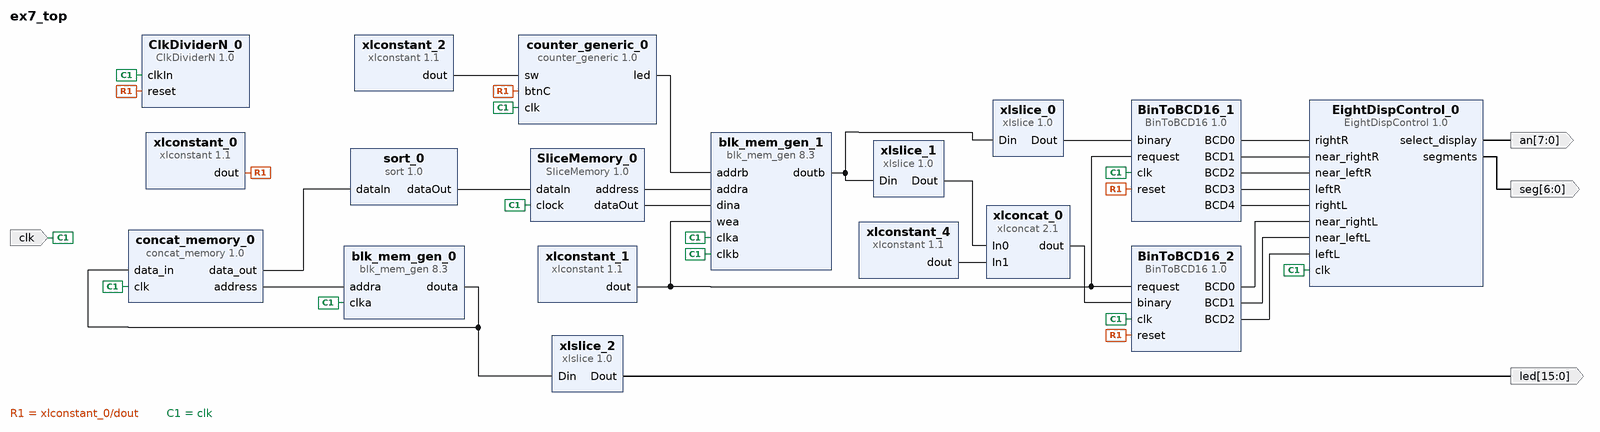
[diagram p0: block diagram of the top level]
# Vivado block design ex7_top, xc7a100tcsg324-3, Vivado 2016.4
create_bd_design ex7_top

create_bd_port -dir I clk
create_bd_port -dir O -from 7 -to 0 an
create_bd_port -dir O -from 6 -to 0 seg
create_bd_port -dir O -from 15 -to 0 led

create_bd_cell -type ip -vlnv xilinx.com:ip:blk_mem_gen:8.3 blk_mem_gen_0
set_property -dict [list \
  CONFIG.Memory_Type Single_Port_ROM \
  CONFIG.Enable_32bit_Address false \
  CONFIG.Write_Width_A 22 \
  CONFIG.Enable_A Always_Enabled \
  CONFIG.Register_PortA_Output_of_Memory_Primitives true \
  CONFIG.Load_Init_File true \
  CONFIG.Coe_File ../../../../../../../ex1/vector16_8bits_random.coe \
  CONFIG.Use_RSTA_Pin false \
  CONFIG.Port_A_Write_Rate 0 \
  CONFIG.use_bram_block Stand_Alone \
] [get_bd_cells blk_mem_gen_0]
create_bd_cell -type ip -vlnv xilinx.com:user:ClkDividerN:1.0 ClkDividerN_0
set_property -dict {CONFIG.divFactor 100000000} [get_bd_cells ClkDividerN_0]
create_bd_cell -type ip -vlnv xilinx.com:user:concat_memory:1.0 concat_memory_0
set_property -dict {CONFIG.bits 22 CONFIG.words 8 CONFIG.log_words 3} [get_bd_cells concat_memory_0]
create_bd_cell -type ip -vlnv xilinx.com:ip:xlconstant:1.1 xlconstant_0
set_property -dict {CONFIG.CONST_VAL 0} [get_bd_cells xlconstant_0]
create_bd_cell -type ip -vlnv xilinx.com:ip:blk_mem_gen:8.3 blk_mem_gen_1
set_property -dict [list \
  CONFIG.Memory_Type Simple_Dual_Port_RAM \
  CONFIG.Enable_32bit_Address false \
  CONFIG.Use_Byte_Write_Enable false \
  CONFIG.Write_Width_A 22 \
  CONFIG.Operating_Mode_A NO_CHANGE \
  CONFIG.Enable_A Always_Enabled \
  CONFIG.Write_Width_B 22 \
  CONFIG.Read_Width_B 22 \
  CONFIG.Enable_B Always_Enabled \
  CONFIG.Register_PortB_Output_of_Memory_Primitives true \
  CONFIG.Port_B_Clock 100 \
  CONFIG.Port_B_Enable_Rate 100 \
  CONFIG.use_bram_block Stand_Alone \
] [get_bd_cells blk_mem_gen_1]
create_bd_cell -type ip -vlnv xilinx.com:ip:xlconstant:1.1 xlconstant_1
create_bd_cell -type ip -vlnv ua.pt:user:EightDispControl:1.0 EightDispControl_0
create_bd_cell -type ip -vlnv xilinx.com:user:SliceMemory:1.0 SliceMemory_0
set_property -dict {CONFIG.bits 22 CONFIG.words 8 CONFIG.log_words 3} [get_bd_cells SliceMemory_0]
create_bd_cell -type ip -vlnv xilinx.com:ip:xlslice:1.0 xlslice_0
set_property -dict {CONFIG.DOUT_WIDTH 16 CONFIG.DIN_TO 0 CONFIG.DIN_FROM 15 CONFIG.DIN_WIDTH 22} [get_bd_cells xlslice_0]
create_bd_cell -type ip -vlnv xilinx.com:ip:xlslice:1.0 xlslice_1
set_property -dict {CONFIG.DOUT_WIDTH 6 CONFIG.DIN_TO 16 CONFIG.DIN_FROM 21 CONFIG.DIN_WIDTH 22} [get_bd_cells xlslice_1]
create_bd_cell -type ip -vlnv xilinx.com:ip:xlconstant:1.1 xlconstant_4
set_property -dict {CONFIG.CONST_WIDTH 10 CONFIG.CONST_VAL 0} [get_bd_cells xlconstant_4]
create_bd_cell -type ip -vlnv xilinx.com:ip:xlconcat:2.1 xlconcat_0
set_property -dict {CONFIG.NUM_PORTS 2 CONFIG.IN0_WIDTH 6 CONFIG.IN1_WIDTH 10} [get_bd_cells xlconcat_0]
create_bd_cell -type ip -vlnv ua.pt:user:BinToBCD16:1.0 BinToBCD16_1
create_bd_cell -type ip -vlnv ua.pt:user:BinToBCD16:1.0 BinToBCD16_2
create_bd_cell -type ip -vlnv xilinx.com:ip:xlslice:1.0 xlslice_2
set_property -dict {CONFIG.DOUT_WIDTH 16 CONFIG.DIN_TO 0 CONFIG.DIN_FROM 15 CONFIG.DIN_WIDTH 22} [get_bd_cells xlslice_2]
create_bd_cell -type ip -vlnv xilinx.com:user:sort:1.0 sort_0
create_bd_cell -type ip -vlnv xilinx.com:user:counter_generic:1.0 counter_generic_0
set_property -dict {CONFIG.nr_bits 3} [get_bd_cells counter_generic_0]
create_bd_cell -type ip -vlnv xilinx.com:ip:xlconstant:1.1 xlconstant_2
set_property -dict {CONFIG.CONST_WIDTH 2} [get_bd_cells xlconstant_2]

# ---- connections ----

connect_bd_net [get_bd_pins xlconstant_0/dout] \
  [get_bd_pins ClkDividerN_0/reset] [get_bd_pins BinToBCD16_1/reset] [get_bd_pins BinToBCD16_2/reset] \
  [get_bd_pins counter_generic_0/btnC]
connect_bd_net [get_bd_pins blk_mem_gen_0/douta] [get_bd_pins concat_memory_0/data_in] [get_bd_pins xlslice_2/Din]
connect_bd_net [get_bd_ports clk] \
  [get_bd_pins concat_memory_0/clk] [get_bd_pins blk_mem_gen_0/clka] [get_bd_pins ClkDividerN_0/clkIn] \
  [get_bd_pins EightDispControl_0/clk] [get_bd_pins SliceMemory_0/clock] [get_bd_pins BinToBCD16_1/clk] \
  [get_bd_pins BinToBCD16_2/clk] [get_bd_pins counter_generic_0/clk] [get_bd_pins blk_mem_gen_1/clkb] \
  [get_bd_pins blk_mem_gen_1/clka]
connect_bd_net [get_bd_pins concat_memory_0/address] [get_bd_pins blk_mem_gen_0/addra]
connect_bd_net [get_bd_pins xlconstant_1/dout] [get_bd_pins blk_mem_gen_1/wea] [get_bd_pins BinToBCD16_1/request] [get_bd_pins BinToBCD16_2/request]
connect_bd_net [get_bd_pins EightDispControl_0/select_display] [get_bd_ports an]
connect_bd_net [get_bd_pins EightDispControl_0/segments] [get_bd_ports seg]
connect_bd_net [get_bd_pins SliceMemory_0/address] [get_bd_pins blk_mem_gen_1/addra]
connect_bd_net [get_bd_pins xlconstant_4/dout] [get_bd_pins xlconcat_0/In1]
connect_bd_net [get_bd_pins xlslice_1/Dout] [get_bd_pins xlconcat_0/In0]
connect_bd_net [get_bd_pins xlslice_0/Dout] [get_bd_pins BinToBCD16_1/binary]
connect_bd_net [get_bd_pins BinToBCD16_1/BCD0] [get_bd_pins EightDispControl_0/rightR]
connect_bd_net [get_bd_pins BinToBCD16_1/BCD1] [get_bd_pins EightDispControl_0/near_rightR]
connect_bd_net [get_bd_pins BinToBCD16_1/BCD2] [get_bd_pins EightDispControl_0/near_leftR]
connect_bd_net [get_bd_pins BinToBCD16_1/BCD3] [get_bd_pins EightDispControl_0/leftR]
connect_bd_net [get_bd_pins BinToBCD16_1/BCD4] [get_bd_pins EightDispControl_0/rightL]
connect_bd_net [get_bd_pins xlconcat_0/dout] [get_bd_pins BinToBCD16_2/binary]
connect_bd_net [get_bd_pins BinToBCD16_2/BCD0] [get_bd_pins EightDispControl_0/near_rightL]
connect_bd_net [get_bd_pins BinToBCD16_2/BCD1] [get_bd_pins EightDispControl_0/near_leftL]
connect_bd_net [get_bd_pins BinToBCD16_2/BCD2] [get_bd_pins EightDispControl_0/leftL]
connect_bd_net [get_bd_pins xlslice_2/Dout] [get_bd_ports led]
connect_bd_net [get_bd_pins sort_0/dataOut] [get_bd_pins SliceMemory_0/dataIn]
connect_bd_net [get_bd_pins concat_memory_0/data_out] [get_bd_pins sort_0/dataIn]
connect_bd_net [get_bd_pins counter_generic_0/led] [get_bd_pins blk_mem_gen_1/addrb]
connect_bd_net [get_bd_pins xlconstant_2/dout] [get_bd_pins counter_generic_0/sw]
connect_bd_net [get_bd_pins SliceMemory_0/dataOut] [get_bd_pins blk_mem_gen_1/dina]
connect_bd_net [get_bd_pins blk_mem_gen_1/doutb] [get_bd_pins xlslice_1/Din] [get_bd_pins xlslice_0/Din]

validate_bd_design
save_bd_design
